# EAGLE schematic eagleschem (EAGLE 9.3.0)
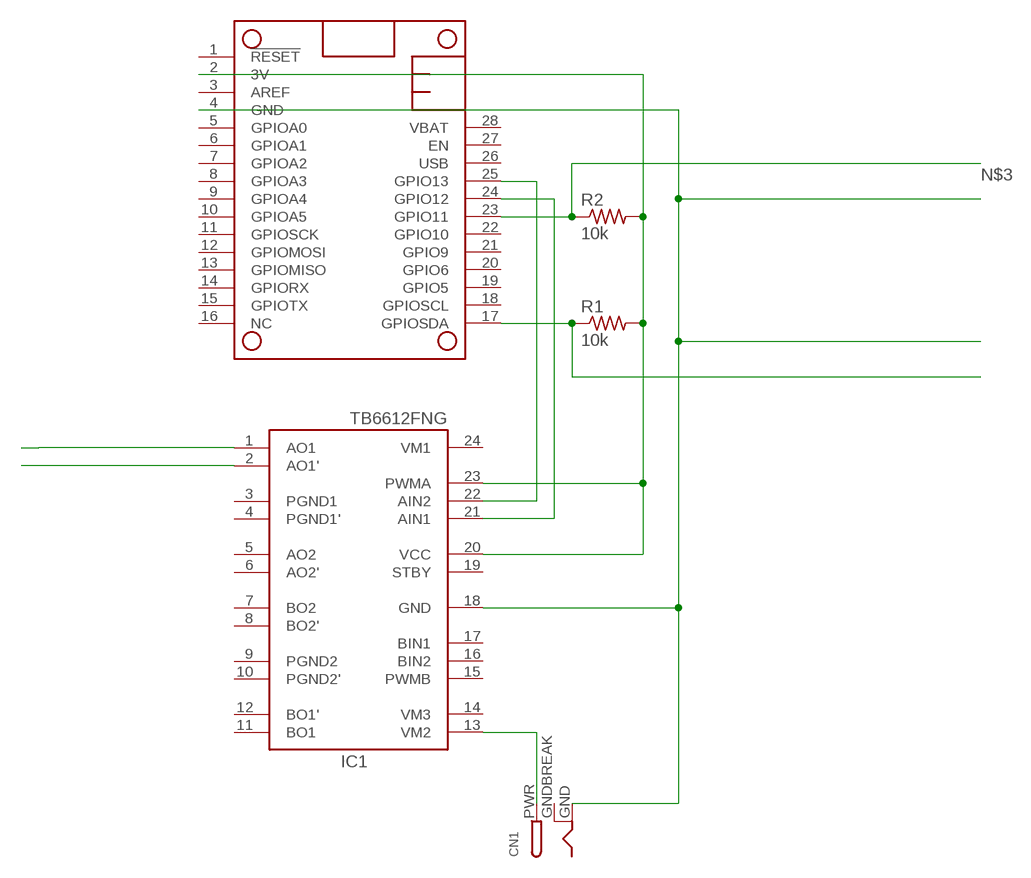
[diagram p0: schematic, sheet 1]

## Parts
CN1  DCBARRELPTH  [DCJACK_2MM_PTH]
IC1  TB6612FNG  [SSOP24]
MS1  FEATHERWING  [FEATHERWING]
R1  10k  R-US_0204/2V  [0204V]
R2  10k  R-US_0204/2V  [0204V]

## Nets
3V: IC1.20(VCC) IC1.23(PWMA) MS1.2(3V) R1.2 R2.2
N$1: IC1.22(AIN2) MS1.25(GPIO13)
N$2: IC1.21(AIN1) MS1.24(GPIO12)
N$3: MS1.23(GPIO11) R2.1
N$4: MS1.17(GPIOSDA) R1.1
N$5: IC1.1(AO1)
N$6: IC1.2(AO1')
N$7: CN1.GND IC1.18(GND) MS1.4(GND)
N$8: CN1.PWR IC1.13(VM2)
Unconnected: IC1.5(AO2) IC1.6(AO2') IC1.7(BO2) IC1.8(BO2') IC1.11(BO1) IC1.12(BO1') IC1.15(PWMB) IC1.16(BIN2) IC1.17(BIN1) IC1.19(STBY) MS1.1(!RESET) MS1.3(AREF) MS1.5(GPIOA0) MS1.6(GPIOA1) MS1.7(GPIOA2) MS1.8(GPIOA3) MS1.9(GPIOA4) MS1.10(GPIOA5) MS1.11(GPIOSCK) MS1.12(GPIOMOSI) MS1.13(GPIOMISO) MS1.14(GPIORX) MS1.15(GPIOTX) MS1.16(NC) MS1.18(GPIOSCL) MS1.19(GPIO5) MS1.20(GPIO6) MS1.21(GPIO9) MS1.22(GPIO10) MS1.26(USB) MS1.27(EN) MS1.28(VBAT)

## Power pins joined to a net without a drawn wire
GNDBREAK: CN1.GNDBREAK
PGND1: IC1.3(PGND1)
PGND1': IC1.4(PGND1')
PGND2: IC1.9(PGND2)
PGND2': IC1.10(PGND2')
VM1: IC1.24(VM1)
VM3: IC1.14(VM3)

## Library data of the parts
CN1 = adafruit:DCBARREL: 2.0mm DC Barrel Jack DCJACK_2MM_PTH - Through Hole Jack (4UConnector: 05537)
IC1 = adafruit:TB6612FNG: TB6612FNG MOS dual H-bridge motor driver, 1.2A current 3.2A peak 3 or 5v logic and 3-15v motor
MS1 = adafruit:FEATHERWING
R1 R2 = adafruit:R-US_: RESISTOR, American symbol